# Altium schematic sheet lght.SchDoc
size A3
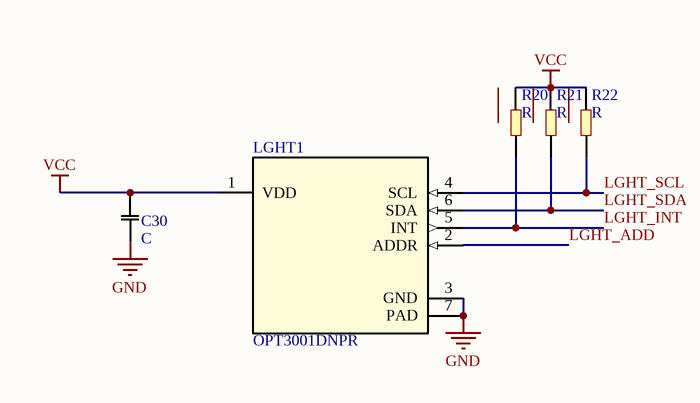
[diagram p0: lght.SchDoc]

## Parts
C30  C  [402]
LGHT1  OPT3001DNPR  [DNP0006A]
R20  R  [402]
R21  R  [402]
R22  R  [402]

## Nets
GND: C30.1 LGHT1.3(GND) LGHT1.7(PAD)
VCC: C30.2 LGHT1.1(VDD) R20.2 R21.2 R22.2
LGHT_ADD: LGHT1.2(ADDR)
LGHT_INT: LGHT1.5(INT) R20.1
LGHT_SCL: LGHT1.4(SCL) R22.1
LGHT_SDA: LGHT1.6(SDA) R21.1

## Library data of the parts
C30 = C: Capacitor
LGHT1 = OPT3001DNPR: Imported; Manufacturer: Texas Instruments; CompType: IC; PIN_COUNT: 7; Application_BuildNumber: *; PartNumber: OPT3001DNP; PackageReference: DNP0006A; MountType: SMT; RoHS: Y; RefDes: RefDes; TYPE: TYPE; Value: Value
R20-R22 = R: Resistor